# EAGLE schematic quadcopter_control_v0.1 (EAGLE 5.11)
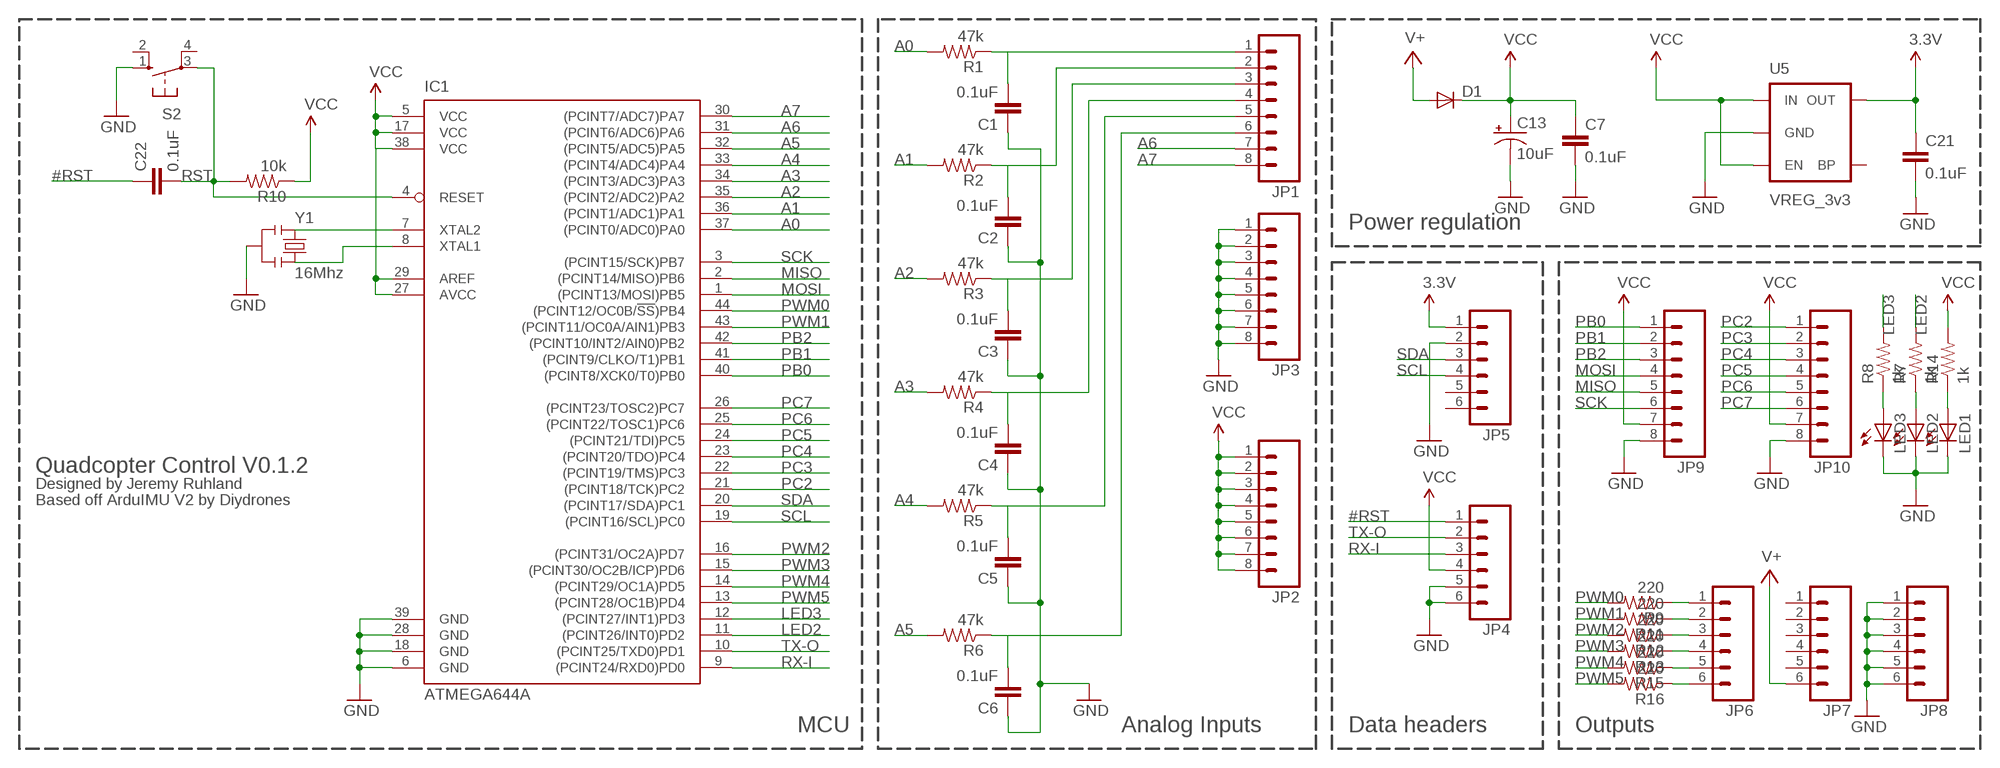
[diagram p0: schematic, sheet 1]

## Parts
C1  0.1uF  CAP0402-CAP  [0402-CAP]
C2  0.1uF  CAP0402-CAP  [0402-CAP]
C3  0.1uF  CAP0402-CAP  [0402-CAP]
C4  0.1uF  CAP0402-CAP  [0402-CAP]
C5  0.1uF  CAP0402-CAP  [0402-CAP]
C6  0.1uF  CAP0402-CAP  [0402-CAP]
C7  0.1uF  CAP0402-CAP  [0402-CAP]
C13  10uF  CAP_POL1206  [EIA3216]
C21  0.1uF  CAP0402-CAP  [0402-CAP]
C22  0.1uF  CAP0402-CAP  [0402-CAP]
D1  DIODESMA  [SMA-DIODE]
IC1  ATMEGA644A  [TQFP44]
JP1  M08LOCK  [1X08_LOCK]
JP2  M08LOCK  [1X08_LOCK]
JP3  M08LOCK  [1X08_LOCK]
JP4  M06LOCK  [1X06_LOCK]
JP5  M06LOCK  [1X06_LOCK]
JP6  M06LOCK  [1X06_LOCK]
JP7  M06LOCK  [1X06_LOCK]
JP8  M06LOCK  [1X06_LOCK]
JP9  M08LOCK  [1X08_LOCK]
JP10  M08LOCK  [1X08_LOCK]
LED1  LED0603  [LED-0603]
LED2  LED0603  [LED-0603]
LED3  LED0603  [LED-0603]
R1  47k  RESISTOR0402-RES  [0402-RES]
R2  47k  RESISTOR0402-RES  [0402-RES]
R3  47k  RESISTOR0402-RES  [0402-RES]
R4  47k  RESISTOR0402-RES  [0402-RES]
R5  47k  RESISTOR0402-RES  [0402-RES]
R6  47k  RESISTOR0402-RES  [0402-RES]
R7  1k  RESISTOR0402-RES  [0402-RES]
R8  1k  RESISTOR0402-RES  [0402-RES]
R9  220  RESISTOR0402-RES  [0402-RES]
R10  10k  RESISTOR0402-RES  [0402-RES]
R11  220  RESISTOR0402-RES  [0402-RES]
R12  220  RESISTOR0402-RES  [0402-RES]
R13  220  RESISTOR0402-RES  [0402-RES]
R14  1k  RESISTOR0402-RES  [0402-RES]
R15  220  RESISTOR0402-RES  [0402-RES]
R16  220  RESISTOR0402-RES  [0402-RES]
S2  10-XX  [B3F-10XX]
U5  VREG_3v3  V_REG_LDOSMD  [SOT23-5]
Y1  16Mhz  RESONATORSMD  [RESONATOR-SMD]

## Nets
3.3V: C21.1 JP5.1 U5.5(OUT)
#RST: C22.1 JP4.1
A0: IC1.37((PCINT0/ADC0)PA0) R1.2
A1: IC1.36((PCINT1/ADC1)PA1) R2.2
A2: IC1.35((PCINT2/ADC2)PA2) R3.2
A3: IC1.34((PCINT3/ADC3)PA3) R4.2
A4: IC1.33((PCINT4/ADC4)PA4) R5.2
A5: IC1.32((PCINT5/ADC5)PA5) R6.2
A6: IC1.31((PCINT6/ADC6)PA6) JP1.7
A7: IC1.30((PCINT7/ADC7)PA7) JP1.8
GND: C1.1 C2.1 C3.1 C4.1 C5.1 C6.1 C7.2 C13.C(-) C21.2 IC1.6(GND) IC1.18(GND) IC1.28(GND) IC1.39(GND) JP3.1 JP3.2 JP3.3 JP3.4 JP3.5 JP3.6 JP3.7 JP3.8 JP4.5 JP4.6 JP5.2 JP8.1 JP8.2 JP8.3 JP8.4 JP8.5 JP8.6 JP9.8 JP10.8 LED1.C LED2.C LED3.C S2.1(S) U5.2(GND) Y1.2
LED2: IC1.11((PCINT26/INT0)PD2) R7.2
LED3: IC1.12((PCINT27/INT1)PD3) R8.2
MISO: IC1.2((PCINT14/MISO)PB6) JP9.5
MOSI: IC1.1((PCINT13/MOSI)PB5) JP9.4
N$1: C1.2 JP1.1 R1.1
N$2: C2.2 JP1.2 R2.1
N$3: C3.2 JP1.3 R3.1
N$4: C4.2 JP1.4 R4.1
N$5: IC1.8(XTAL1) Y1.3
N$6: C5.2 JP1.5 R5.1
N$7: IC1.7(XTAL2) Y1.1
N$8: C6.2 JP1.6 R6.1
N$9: LED2.A R7.1
N$10: LED3.A R8.1
N$13: JP6.6 R16.1
N$17: LED1.A R14.1
N$25: JP6.5 R15.1
N$26: JP6.4 R13.1
N$27: JP6.3 R12.1
N$28: JP6.2 R11.1
N$29: JP6.1 R9.1
PB0: IC1.40((PCINT8/XCK0/T0)PB0) JP9.1
PB1: IC1.41((PCINT9/CLKO/T1)PB1) JP9.2
PB2: IC1.42((PCINT10/INT2/AIN0)PB2) JP9.3
PC2: IC1.21((PCINT18/TCK)PC2) JP10.1
PC3: IC1.22((PCINT19/TMS)PC3) JP10.2
PC4: IC1.23((PCINT20/TDO)PC4) JP10.3
PC5: IC1.24((PCINT21/TDI)PC5) JP10.4
PC6: IC1.25((PCINT22/TOSC1)PC6) JP10.5
PC7: IC1.26((PCINT23/TOSC2)PC7) JP10.6
PWM0: IC1.44((PCINT12/OC0B/!SS!)PB4) R9.2
PWM1: IC1.43((PCINT11/OC0A/AIN1)PB3) R11.2
PWM2: IC1.16((PCINT31/OC2A)PD7) R12.2
PWM3: IC1.15((PCINT30/OC2B/ICP)PD6) R13.2
PWM4: IC1.14((PCINT29/OC1A)PD5) R15.2
PWM5: IC1.13((PCINT28/OC1B)PD4) R16.2
RST: C22.2 IC1.4(RESET) R10.2 S2.3(P)
RX-I: IC1.9((PCINT24/RXD0)PD0) JP4.3
SCK: IC1.3((PCINT15/SCK)PB7) JP9.6
SCL: IC1.19((PCINT16/SCL)PC0) JP5.4
SDA: IC1.20((PCINT17/SDA)PC1) JP5.3
TX-O: IC1.10((PCINT25/TXD0)PD1) JP4.2
V+: D1.A JP7.6
VCC: C7.1 C13.A(+) D1.C IC1.5(VCC) IC1.17(VCC) IC1.27(AVCC) IC1.29(AREF) IC1.38(VCC) JP2.1 JP2.2 JP2.3 JP2.4 JP2.5 JP2.6 JP2.7 JP2.8 JP4.4 JP9.7 JP10.7 R10.1 R14.2 U5.1(IN) U5.3(EN)
Unconnected: JP5.5 JP5.6 JP7.1 JP7.2 JP7.3 JP7.4 JP7.5 S2.2(S1) S2.4(P1) U5.4(BP)

## Notes on the sheet
- Power regulation
- Quadcopter Control V0.1.2
- Designed by Jeremy Ruhland
- Based off ArduIMU V2 by Diydrones
- MCU | Analog Inputs | Data headers | Outputs

## Library data of the parts
C1-C7 C21 C22 = SparkFun:CAP: Capacitor Standard 0603 ceramic capacitor, and 0.1" leaded capacitor.
C13 = SparkFun:CAP_POL: Capacitor Polarized These are standard SMD and PTH capacitors. Normally 10uF, 47uF, and 100uF in electrolytic and tantalum varieties. Always verify the external diameter of the through hole cap, it varies with capacity, voltage, and manufacturer. The EIA devices should be standard.
D1 = DIYdrones3:DIODE: Diode These are standard reverse protection diodes and small signal diodes. SMA package can handle up to about 1A. SOD-323 can handle about 200mA. What the SOD-323 package when ordering, there are some mfgs out there that are 5-pin packages.
IC1 = atmel:ATMEGA644: 8-bit Microcontroller with 64K Bytes In-System Programmable Flash Source: http://www.atmel.com/dyn/resources/prod_documents/doc2593.pdf; MPN: ATMEGA644PV-10AU; OC_FARNELL: 1455123; OC_NEWARK: 58M3748
JP1-JP3 JP9 JP10 = SparkFun:M08: Header 8 Standard 8-pin 0.1" header. Use with straight break away headers (SKU : PRT-00116), right angle break away headers (PRT-00553), swiss pins (PRT-00743), machine pins (PRT-00117), and female headers (PRT-00115).
JP4-JP8 = SparkFun:M06: Header 6 Standard 6-pin 0.1" header. Use with straight break away headers (SKU : PRT-00116), right angle break away headers (PRT-00553), swiss pins (PRT-00743), machine pins (PRT-00117), and female headers (PRT-00115). Molex polarized connector foot print use with SKU : PRT-08094 with associated crimp pins and housings. NOTES ON THE VARIANTS LOCK and LOCK_LONGPADS... This footprint was designed to help hold the alignment of a through-hole component (i.e. 6-pin header) while soldering it into place. You may notice that each hole has been shifted either up or down by 0.005 of an inch from it's more standard position (which is a perfectly straight line). This slight alteration caused the pins (the squares in the middle) to touch the edges of the holes. Because they are alternating, it causes a "brace" to hold the component in place. 0.005 has proven to be the perfect amount of "off-center" position when using our standard breakaway headers. Although looks a little odd when you look at the bare footprint, once you have a header in there, the alteration is very hard to notice. Also, if you push a header all the way into place, it is covered up entirely on the bottom side. This idea of altering the position of holes to aid alignment will be further integrated into the Sparkfun Library for other footprints. It can help hold any component with 3 or more connection pins.
LED1-LED3 = DIYdrones3:LED: LEDs Standard schematic elements and footprints for 5mm, 3mm, 1206, and 0603 sized LEDs. 5mm - Spark Fun Electronics SKU : COM-00529 (and others)
R1-R16 = SparkFun:RESISTOR: Resistor Basic schematic elements and footprints for 0603, 1206, and PTH 1/10th watt (small) resistors.
S2 = switch-omron:10-XX: OMRON SWITCH; MPN: B3F-1000; OC_FARNELL: 176432; OC_NEWARK: 36M3542
U5 = DIYdrones3:V_REG_LDO: Voltage Regulator LDO Standard 150mA LDO voltage regulator in SOT-23 layout. Micrel part MIC5205. BP (by-pass) pin is used to lower output noise with 470pF cap.
Y1 = DIYdrones3:RESONATOR: Resonator Small SMD resonator. This is the itty bitty 10/20MHz resonators with built in caps. CSTCE10M0G55 and CSTCE20M0V53. Footprint has been reviewed closely but hasn't been tested yet.